# Altium project SolderStation.PrjPcb
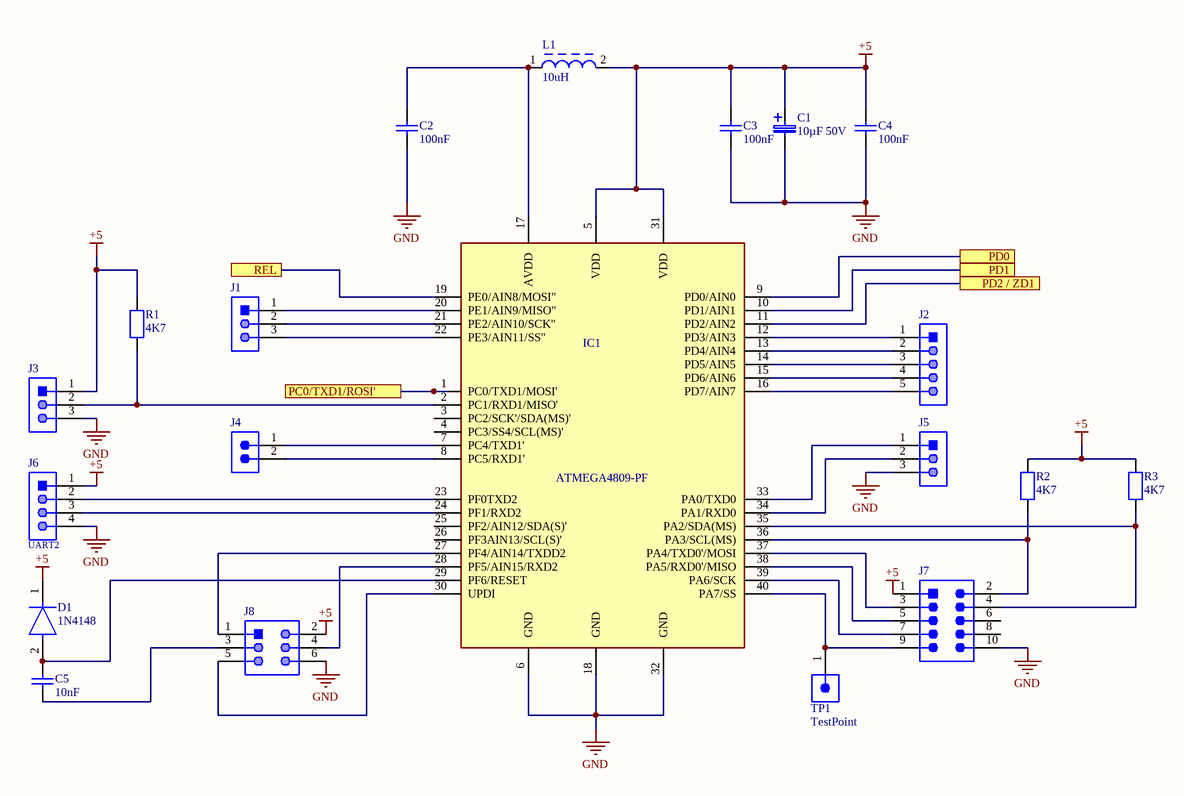
[diagram p0: CPU.SchDoc]
Drawn By: Robert Jansen
4 sheets, 70 parts. Net scope: flat (ports and power ports of the same name join across sheets).
Board file: solderStation.PcbDoc
Sheets:
  CPU.SchDoc
  SolderIronTemp.SchDoc
  SolderIronOut.SchDoc
  BatterySource_RelaisOut.SchDoc

## Sheet CPU.SchDoc
size A4; SheetNumber: 1; SheetTotal: 5

### Parts
C1  10µF 50V  [TAP106M050BRW]
C2  100nF  [CAPC2012X88N]
C3  100nF  [CAPC2012X88N]
C4  100nF  [CAPC2012X88N]
C5  10nF  [CAPC2012X88N]
D1  1N4148  [FP-017AG-MFG]
IC1  ATMEGA4809-PF  [ATMEGA4809-PF]
J1  61300311121  [pin header 1x3]  (value not drawn)
J2  61300511121  [pin header 1x5]  (value not drawn)
J3  61300311121  [pin header 1x3]  (value not drawn)
J4  61300211121  [61300211121]  (value not drawn)
J5  61300311121  [pin header 1x3]  (value not drawn)
J6  UART2  [pin header 1x4]
J7  1-1634688-0  [TECO-1-1634688-0-10_V]  (value not drawn)
J8  61300621121  [pin header 2x6]  (value not drawn)
L1  10uH  [SMD-1008]
R1  4K7  [RESC2012X50N]
R2  4K7  [RESC2012X50N]
R3  4K7  [RESC2012X50N]
TP1  TestPoint  [61300111121]

### Ports
PC0/TXD1/ROSI' (see SolderIronOut[1B]), PD0 (see SolderIronTemp[1A]), PD1 (see SolderIronTemp[1C]), PD2 / ZD1 (see BatterySource_RelaisOut[3B]), REL (see BatterySource_RelaisOut[1C])

### Nets
+5: C1.1 C3.2 C4.2 D1.1(C) IC1.5(VDD) IC1.31(VDD) J3.1 J6.1 J7.1 J8.2 L1.2 R1.1 R2.2 R3.2
GND: C1.2 C2.1 C3.1 C4.1 IC1.6(GND) IC1.18(GND) IC1.32(GND) J3.3 J5.3 J6.4 J7.10 J8.6
NetC2_2: C2.2 IC1.17(AVDD) L1.1
NetC5_1: C5.1 J8.3
NetC5_2: C5.2 D1.2(A) IC1.29(PF6/RESET)
NetC6_2: IC1.9(PD0/AIN0) ; port PD0
NetC10_2: IC1.10(PD1/AIN1) ; port PD1
NetIC1_1: IC1.1(PC0/TXD1/MOSI') ; port PC0/TXD1/ROSI'
NetIC1_2: IC1.2(PC1/RXD1/MISO') J3.2 R1.2
NetIC1_7: IC1.7(PC4/TXD1') J4.1
NetIC1_8: IC1.8(PC5/RXD1') J4.2
NetIC1_11: IC1.11(PD2/AIN2) ; port PD2 / ZD1
NetIC1_12: IC1.12(PD3/AIN3) J2.1
NetIC1_13: IC1.13(PD4/AIN4) J2.2
NetIC1_14: IC1.14(PD5/AIN5) J2.3
NetIC1_15: IC1.15(PD6/AIN6) J2.4
NetIC1_16: IC1.16(PD7/AIN7) J2.5
NetIC1_19: IC1.19(PE0/AIN8/MOSI") ; port REL
NetIC1_20: IC1.20(PE1/AIN9/MISO") J1.1
NetIC1_21: IC1.21(PE2/AIN10/SCK") J1.2
NetIC1_22: IC1.22(PE3/AIN11/SS") J1.3
NetIC1_23: IC1.23(PF0TXD2) J6.2
NetIC1_24: IC1.24(PF1/RXD2) J6.3
NetIC1_27: IC1.27(PF4/AIN14/TXDD2) J8.1
NetIC1_28: IC1.28(PF5/AIN15/RXD2) J8.4
NetIC1_30: IC1.30(UPDI) J8.5
NetIC1_33: IC1.33(PA0/TXD0) J5.1
NetIC1_34: IC1.34(PA1/RXD0) J5.2
NetIC1_35: IC1.35(PA2/SDA(MS)) J7.4 R3.1
NetIC1_36: IC1.36(PA3/SCL(MS)) J7.2 R2.1
NetIC1_37: IC1.37(PA4/TXD0'/MOSI) J7.3
NetIC1_38: IC1.38(PA5/RXD0'/MISO) J7.5
NetIC1_39: IC1.39(PA6/SCK) J7.7
NetIC1_40: IC1.40(PA7/SS) J7.9 TP1.1

Not connected (* = marked no-connect by the designer): IC1 3(PC2/SCK'/SDA(MS)') 4(PC3/SS4/SCL(MS)') 25(PF2/AIN12/SDA(S)') 26(PF3AIN13/SCL(S)'); J7 6 8

### Library data of the parts
C1 = capacitor THT radial tantalum: Tantalum Capacitors - Solid Leaded 50V 10uF 20% ESR=1.6 Ohm TAP106M050BRW; Manufacturer_Name: Kyocera AVX; Geometry.Height: 15.5mm; Mouser Part Number: 581-TAP106M050BRW; Mouser Price/Stock: https://www.mouser.co.uk/ProductDetail/AVX/TAP106M050BRW?qs=GjEaAqXp9rZGx11KfVU76g%3D%3D; Manufacturer_Part_Number: TAP106M050BRW; Datasheet Link: https://www.mouser.be/datasheet/2/40/tap-776819.pdf
C2-C5 = Capacitor ceramic 0805: Manufacturer: Kemet; Part Number: C0402C104K4RACTU
D1 = D 1N4148: DIODE GEN PURP 100V 200MA DO35; Forward Voltage: 1V; Max Power Dissipation: 500mW; Max Reverse Current: 5uA; Forward Current: 300mA; Current: 4A; Reverse Recovery Time: 4ns; Element Configuration: Single; Outside Diameter: 1.85mm; Capacitance: 4pF; Polarity: Standard; Max Forward Surge Current (Ifsm): 1A; Reverse Voltage: 100V; Output Current: 200mA; Average Rectified Current: 200mA; Diameter: 1.91mm; Max Repetitive Reverse Voltage (Vrrm): 100V; Current Rating: 200mA; Case/Package: DO-35; Lead Free: Lead Free; Number of Pins: 2; Recovery Time: 4ns; Packaging: Bulk; Contact Plating: Tin; Voltage: 100V; Mount: Through Hole; Max Surge Current: 4A; Package Quantity: 2000; Width: 1.91mm; Max Reverse Voltage (DC): 100V; Length: 4.56mm; Radiation Hardening: No; Power Dissipation: 500mW; Voltage Rating (DC): 100V; Peak Non-Repetitive Surge Current: 4A; REACH SVHC: No SVHC; Height: 4.56mm; Max Operating Temperature: 175°C; Series: -; Weight: 0.01lb; Min Operating Temperature: -65°C
IC1 = ATMEGA4809-PF: IC MCU 8BIT 48KB FLASH 40DIP; RoHS Compliant: Yes
J1 J3 = pin header 1x3pin right connection: THT Vertical Pin Header WR-PHD, Pitch 2.54 mm, Single Row, 3 pins; Manufacturer: Wurth Elektronik; Withstanding Voltage: 500VAC; Working Voltage: 250VAC; Rated Current: 3A; Pitch: 2.54mm; Pin Number: 3; Gender: Male; Contact Resistance: 20mOhm; Package Reference: 61300311121; Manufacturer URL: http://www.we-online.de; Datasheet URL: https://katalog.we-online.de/em/datasheet/6130xx11121.pdf; Operating Temperature: -40to105degC; Part Number: 61300311121; Orientation: Vertical; Packaging: Bag; Row Number: Single; Mounting Technology: THT; Publisher: WurthElektronik
J2 = pin header 1x5: THT Vertical Pin Header WR-PHD, Pitch 2.54 mm, Single Row, 5 pins; Manufacturer: Wurth Elektronik; Pin Number: 5; Contact Resistance: 20mOhm; Working Voltage: 250VAC; Pitch: 2.54mm; Withstanding Voltage: 500VAC; Rated Current: 3A; Gender: Male; Datasheet URL: https://katalog.we-online.de/em/datasheet/6130xx11121.pdf; Orientation: Vertical; Mounting Technology: THT; Row Number: Single; Package Reference: 61300511121; Publisher: WurthElektronik; Part Number: 61300511121; Packaging: Bag; Manufacturer URL: http://www.we-online.de; Operating Temperature: -40to105degC
J4 = Pin header 1X2 right connection: THT Vertical Pin Header WR-PHD, Pitch 2.54 mm, Single Row, 2 pins; NexarPartId: 20081794; Operating Supply Voltage: 250V; Current Rating: 3A; Gender: Male; Number of Contacts: 2; Pitch: 2.54mm; Connector Type: Male Pin; Contact Resistance: 20mΩ; Contact Plating: Gold; Contact Material: Copper; Number of Pins: 2; Min Operating Temperature: -40°C; Packaging: Bulk; Lead Pitch: 2.54mm; Mount: Through Hole; Orientation: Vertical; RoHS: Compliant; REACH SVHC: No SVHC; Height: 8.94mm; Termination: Through Hole; Number of Positions: 2; Contact Mating Length: 5.9944mm; Color: Black; Contact Gender: Male; Number of Rows: 1; Housing Material: PBT; Lead Free: Lead Free; Voltage Rating: 250V; Max Operating Temperature: 125°C
J5 = pin header 1x3pin: THT Vertical Pin Header WR-PHD, Pitch 2.54 mm, Single Row, 3 pins; Manufacturer: Wurth Elektronik; Withstanding Voltage: 500VAC; Working Voltage: 250VAC; Rated Current: 3A; Pitch: 2.54mm; Pin Number: 3; Gender: Male; Contact Resistance: 20mOhm; Package Reference: 61300311121; Manufacturer URL: http://www.we-online.de; Datasheet URL: https://katalog.we-online.de/em/datasheet/6130xx11121.pdf; Operating Temperature: -40to105degC; Part Number: 61300311121; Orientation: Vertical; Packaging: Bag; Row Number: Single; Mounting Technology: THT; Publisher: WurthElektronik
J6 = pin header 1x4 right connection: THT Vertical Pin Header WR-PHD, Pitch 2.54 mm, Single Row, 4 pins; Manufacturer: Wurth Elektronik; Part Number: 61300411121; Withstanding Voltage: 500VAC; Rated Current: 3A; Working Voltage: 250VAC; Pin Number: 4; Gender: Male; Contact Resistance: 20mOhm; Pitch: 2.54mm; Manufacturer URL: http://www.we-online.de; Operating Temperature: -40to105degC; Packaging: Bag; Mounting Technology: THT; Package Reference: 61300411121; Datasheet URL: https://katalog.we-online.de/em/datasheet/6130xx11121.pdf; Publisher: WurthElektronik; Row Number: Single; Orientation: Vertical
J7 = CMP-2000-05854-1: Male Header, Pitch 2.54 mm, 2 x 5 Postion, Height 9.15 mm, Tail Length 3.2 mm, -40 to 105 degC, RoHS, Bulk; Manufacturer: TE Connectivity; No. of Rows: 2; SVHC: ToBeAdvised; Package Version: Rev. C2, 02/2011; No. of Contacts: 10Contacts; Pitch: 2.54mm; No. of Positions: 10; Contact Termination Type: ThroughHole; Package Description: 10-Pin Connector, Body 20.35 x 8.7 mm, Pitch 2.54 mm; Orientation: Straight; Gender: Header; Mounting Technology: ThroughHole; Product Range: -; PartNumber: 1-1634688-0; Datasheet Version: Rev. C2, 02/2011; Contact Material: Brass; Package URL: https://datasheet.ciiva.com/6831/eng-cd-1634688-c2-6831201.pdf; Package Reference: 1-1634688-0; Pitch Spacing: 2.54mm; Contact Plating: GoldPlatedContacts; Manufacturer URL: http://www.te.com/; Datasheet URL: https://datasheet.ciiva.com/6831/eng-cd-1634688-c2-6831201.pdf
J8 = pin header 2x6: THT Vertical Pin Header WR-PHD, Pitch 2.54 mm, Dual Row, 6 pins; Manufacturer: Wurth Elektronik; Contact Resistance: 20mOhm; Withstanding Voltage: 500VAC; Pin Number: 6; Gender: Male; Pitch: 2.54mm; Working Voltage: 250VAC; Rated Current: 3A; Packaging: Bag; Row Number: Dual; Manufacturer URL: http://www.we-online.de; Part Number: 61300621121; Operating Temperature: -40to105degC; Mounting Technology: THT; Package Reference: 61300621121; Datasheet URL: https://katalog.we-online.de/em/datasheet/6130xx21121.pdf; Orientation: Vertical; Publisher: WurthElektronik
L1 = Choke SMD 10uH: Power Multilayer Inductor WE-PMI, L = 10.00 µH CMP-0227-00001-1; Inductance: 10.00 ÂµH; ComponentLink2Description: Datasheet; PackageDescription: Chip Inductor, 2-Leads, Body 2.5 x 2.0 mm; PackageReference: SMD-1008; ComponentLink1URL: http://www.we-online.com; ComponentLink2URL: http://www.we-online.de/katalog/media/pdf/74479887310.pdf; ComponentLink1Description: Manufacturer Link; PackageVersion: 2008; DatasheetVersion: ver 3, Aug-2009
R1-R3 = resistor 0805: Manufacturer: Vishay Dale; Part Number: CRCW08050000Z0EA
TP1 = TestPoint: NexarPartId: 32855518; Operating Supply Voltage: 250V; Connector Type: Male Pin; Contact Resistance: 20mΩ; Number of Contacts: 1; Gender: Male; Current Rating: 3A; Contact Mating Length: 5.9944mm; Number of Pins: 1; Lead Pitch: 2.54mm; Contact Plating: Gold; RoHS: Compliant; Termination: Solder; Mount: Through Hole; Number of Rows: 1; Orientation: Vertical; Contact Material: Copper; Packaging: Bulk; REACH SVHC: Unknown; Number of Positions: 1; Color: Black

## Sheet SolderIronTemp.SchDoc
size A4; SheetNumber: 2; SheetTotal: 4
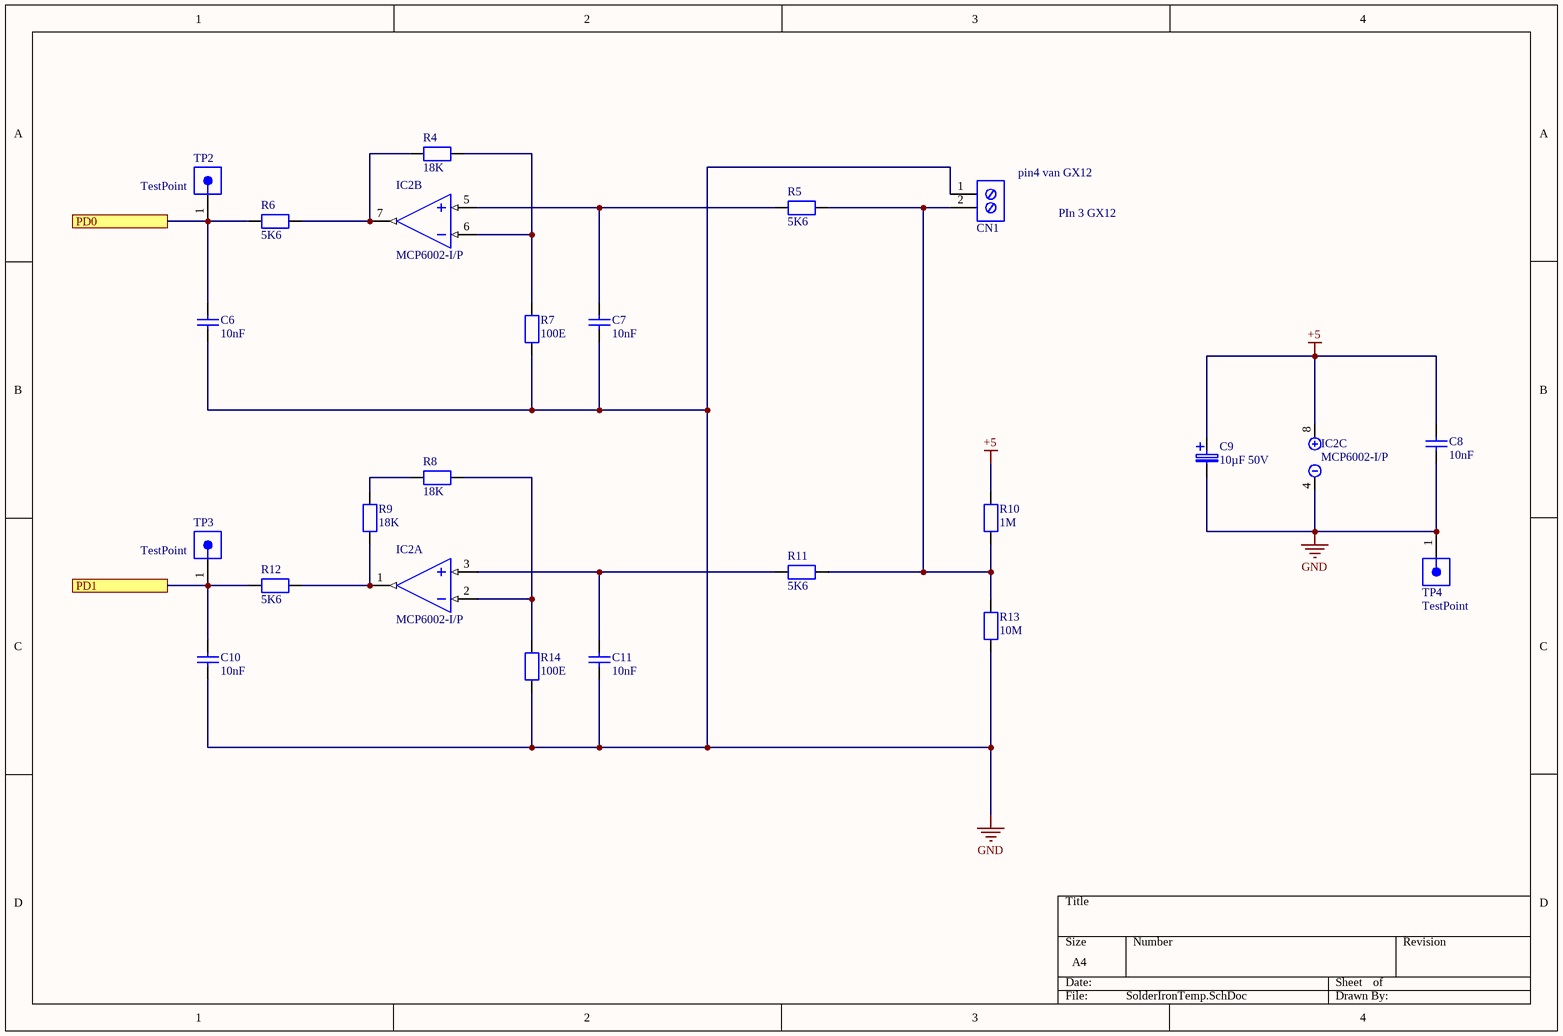
[diagram p1: SolderIronTemp.SchDoc]

### Parts
C6  10nF  [CAPC2012X88N]
C7  10nF  [CAPC2012X88N]
C8  10nF  [CAPC2012X88N]
C9  10µF 50V  [TAP106M050BRW]
C10  10nF  [CAPC2012X88N]
C11  10nF  [CAPC2012X88N]
CN1  Printkroonsteen 2 POL  [Printkroonsteen 2pin]  (value not drawn)
IC2  MCP6002-I/P  [PDIP300-P8]  (parts A,B,C of 3)
R4  18K  [RESC2012X50N]
R5  5K6  [RESC2012X50N]
R6  5K6  [RESC2012X50N]
R7  100E  [RESC2012X50N]
R8  18K  [RESC2012X50N]
R9  18K  [RESC2012X50N]
R10  1M  [RESC2012X50N]
R11  5K6  [RESC2012X50N]
R12  5K6  [RESC2012X50N]
R13  10M  [RESC2012X50N]
R14  100E  [RESC2012X50N]
TP2  TestPoint  [61300111121]
TP3  TestPoint  [61300111121]
TP4  TestPoint  [61300111121]

### Ports
PD0 (see CPU[3B]), PD1 (see CPU[3B])

### Nets
+5: C8.2 C9.1 IC2.8 R10.2
GND: C6.1 C7.1 C8.1 C9.2 C10.1 C11.1 CN1.1 IC2.4 R7.1 R13.1 R14.1 TP4.1
NetC6_2: C6.2 R6.1 TP2.1 ; port PD0
NetC7_2: C7.2 IC2.5(VINB+) R5.1
NetC10_2: C10.2 R12.1 TP3.1 ; port PD1
NetC11_2: C11.2 IC2.3(VINA+) R11.1
NetCN1_2: CN1.2 R5.2 R10.1 R11.2 R13.2
NetIC2_1: IC2.1(VOUTA) R9.1 R12.2
NetIC2_2: IC2.2(VINA-) R8.2 R14.2
NetIC2_6: IC2.6(VINB-) R4.2 R7.2
NetIC2_7: IC2.7(VOUTB) R4.1 R6.2
NetR8_1: R8.1 R9.2

### Notes on the sheet
- (near CN1) pin4 van GX12
- PIn 3 GX12

### Library data of the parts
C6-C8 C10 C11 = Capacitor ceramic 0805: as C2 on sheet CPU
C9 = capacitor THT radial tantalum: as C1 on sheet CPU; Mouser Part Number: 581-TAP106M050BRW; Mouser Price/Stock: https://www.mouser.co.uk/ProductDetail/AVX/TAP106M050BRW?qs=GjEaAqXp9rZGx11KfVU76g%3D%3D; Manufacturer_Part_Number: TAP106M050BRW; Datasheet Link: https://www.mouser.be/datasheet/2/40/tap-776819.pdf
CN1 = printkroonsteen 1 X 2: Printkroonsteen 2 PO L1716020000; Manufacturer_Name: Weidmuller; Datasheet Link: https://catalog.weidmueller.com/catalog/Start.do?ObjectID=1716020000&_ga=2.21797499.1716783809.1613378202-511725545.1613378202; Manufacturer_Part_Number: 1716020000; Mouser Part Number: 470-1716020000; Mouser Price/Stock: https://www.mouser.co.uk/ProductDetail/Weidmuller/1716020000?qs=WJDKaGZ8K%252B7GSEFQgvMjVA%3D%3D
IC2 = CMP-0187-00119-3: Dual opamp; Max Frequency: 1kHz; Operating Supply Current: 100uA; Amplifier Type: GENERAL PURPOSE; Number of Channels: 2; Power Supply Rejection Ratio (PSRR): 86dB; Max Input Voltage: 6V; Bandwidth: 1MHz; Voltage Gain: 112dB; Input Bias Current: 1pA; Slew Rate-Nom: 0.6V/µs; Output Current: 23mA; Input Offset Voltage-Max: 4.5mV; Common Mode Rejection Ratio: 60dB; Min Input Voltage: 1.8V; Operating Supply Voltage: 5.5V; Height: 0.195inch; Number of Circuits: 2; REACH SVHC: No SVHC; Max Supply Voltage: 6V; Supply Current: 100uA; Gain Bandwidth Product: 1MHz; Radiation Hardening: No; Mount: Through Hole; Length: 0.4inch; Number of Pins: 8; Min Operating Temperature: -40°C; Case/Package: PDIP; Number of Amplifiers: 2; RoHS Compliant: Yes; Lead Free: Lead Free; Number of Elements: 2; Technology: CMOS; Width: 0.28inch; Slew Rate: 0.6V/µs; Packaging: Rail/Tube; Output Current per Channel: 23mA; Max Operating Temperature: 85°C; Nominal Supply Current: 100uA; Min Supply Voltage: 1.8V; Input Offset Voltage (Vos): 4.5mV; Unity Gain Bandwidth Product: 1MHz; Package Quantity: 60
R4-R14 = resistor 0805: as R1 on sheet CPU
TP2-TP4 = TestPoint: as TP1 on sheet CPU; Contact Mating Length: 5.9944mm; Number of Pins: 1; Lead Pitch: 2.54mm; Contact Plating: Gold; RoHS: Compliant; Termination: Solder; Mount: Through Hole; Number of Rows: 1; Orientation: Vertical; Contact Material: Copper; Packaging: Bulk; REACH SVHC: Unknown; Number of Positions: 1; Color: Black

## Sheet SolderIronOut.SchDoc: PWM
size 381 x 241 mm; DrawnBy: Jansen Robert; Engineer: Jansen Robert; Organization: PXL; SheetNumber: 3; SheetTotal: 4
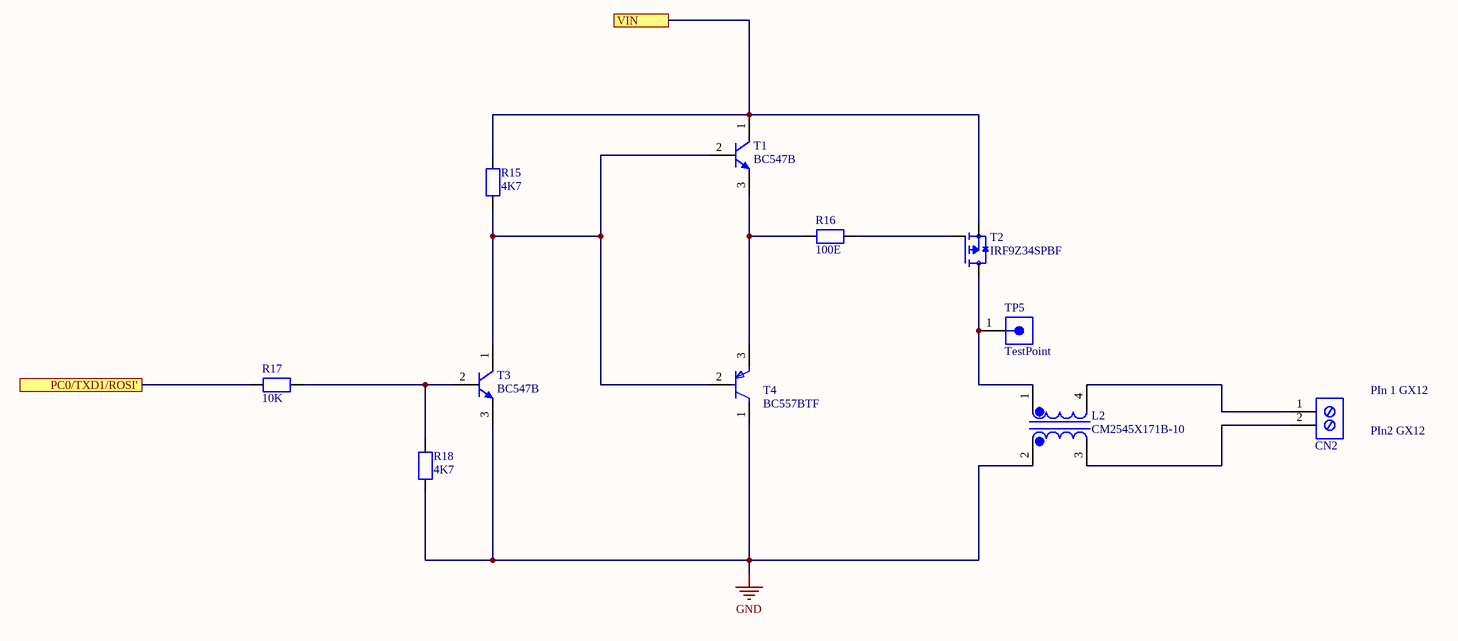
[diagram p2: SolderIronOut.SchDoc]

### Parts
CN2  Printkroonsteen 2 POL  [Printkroonsteen 2pin]  (value not drawn)
L2  CM2545X171B-10  [XFMR_CM2545X171B-10]
R15  4K7  [RESC2012X50N]
R16  100E  [RESC2012X50N]
R17  10K  [RESC2012X50N]
R18  4K7  [RESC2012X50N]
T1  BC547B  [ONSC-TO-92-3-29-11]
T2  IRF9Z34SPBF  [TO254P1521X483-4N]
T3  BC547B  [ONSC-TO-92-3-29-11]
T4  BC557BTF  [ONSC-TO-92-3-29-11]
TP5  TestPoint  [61300111121]

### Ports
PC0/TXD1/ROSI' (see CPU[2B]), VIN (see BatterySource_RelaisOut[3B])

### Nets
GND: L2.2 R18.1 T3.3(E) T4.1(C)
NetCN2_1: CN2.1 L2.4
NetCN2_2: CN2.2 L2.3
NetCN4_2: R15.2 T1.1(C) T2.3(S) ; port VIN
NetIC1_1: R17.2 ; port PC0/TXD1/ROSI'
NetL2_1: L2.1 T2.4(D) TP5.1
NetR15_1: R15.1 T1.2(B) T3.1(C) T4.2(B)
NetR16_1: R16.1 T2.1(G)
NetR16_2: R16.2 T1.3(E) T4.3(E)
NetR17_1: R17.1 R18.2 T3.2(B)

### Notes on the sheet
- PIn 1 GX12
- PIn2 GX12

### Library data of the parts
CN2 = printkroonsteen 1 X 2: as CN1 on sheet SolderIronTemp; Datasheet Link: https://catalog.weidmueller.com/catalog/Start.do?ObjectID=1716020000&_ga=2.21797499.1716783809.1613378202-511725545.1613378202; Manufacturer_Part_Number: 1716020000; Mouser Part Number: 470-1716020000; Mouser Price/Stock: https://www.mouser.co.uk/ProductDetail/Weidmuller/1716020000?qs=WJDKaGZ8K%252B7GSEFQgvMjVA%3D%3D
L2 = CM2545X171B-10: 2 Line Common Mode Choke Through Hole 170 Ohms @ 100 MHz 10A DCR 10mOhm; MF: Laird; Value: *; Purchase-URL: https://pricing.snapeda.com/search/part/CM2545X171B-10/?ref=eda; Price: None; Package: Vertical-4 Laird; SnapEDA_Link: https://www.snapeda.com/parts/CM2545X171B-10/Laird/view-part/?ref=snap; Availability: In Stock; Check_prices: https://www.snapeda.com/parts/CM2545X171B-10/Laird/view-part/?ref=eda; MP: CM2545X171B-10
R15-R18 = resistor 0805: as R1 on sheet CPU
T1 T3 = Transistor NPN BC547B THT: Amplifier Transistor, NPN Silicon, 3-Pin TO-92, Bulk Box CMP-1048-01467-1; Manufacturer: On Semiconductor; IC Continuous (A): 0.1; fT Min (MHz): 150; PackageDescription: 3-Pin Transistor Outline, Body 4.825 x 3.685 mm, Pitch 1.27 mm; ComponentLink3URL: http://www.onsemi.cn/pub_link/Collateral/2N6426-D.PDF; PackageVersion: Rev. AM; Packing: Bulk Box; ComponentLink3Description: Package Specification; ComponentLink2URL: http://www.onsemi.com/pub_link/Collateral/BC546-D.PDF; ComponentLink1URL: http://www.onsemi.com/; ComponentLink2Description: Datasheet; Polarity: NPN; Mounting Technology: Through Hole; PackageReference: TO-92-3-29-11_AM_SL; ComponentLink1Description: Manufacturer URL; PartNumber: BC547B; DatasheetVersion: Rev. 7; RoHS: FALSE
T2 = IRF9Z34SPBF: P-Channel 60V 18A _Tc_ 3.7W _Ta_, 88W _Tc_ Surface Mount D2PAK; MF: Vishay; SnapEDA_Link: https://www.snapeda.com/parts/IRF9Z34SPBF/Vishay%20Siliconix/view-part/390212/?ref=snap; Price: None; MP: IRF9Z34SPBF; Value: *; Availability: Unavailable; Package: D2PAK Vishay
T4 = Transistor PNP BC557 THT: BC557BTF Small Signal Bipolar Transistor, 0.1A I(C), 45V V(BR)CEO, 1-Element, PNP, Silicon, TO-92 CMP-00278-84408945-1; Manufacturer Lifecycle Status: ACTIVE; Max Power Dissipation: 500mW; Frequency: 150MHz; hFE Min: 110; Number of Elements: 1; Current Rating: -100mA; Collector Emitter Saturation Voltage: -250mV; Max Collector Current: 100mA; Emitter Base Voltage (VEBO): -5V; Voltage Rating (DC): -45V; Element Configuration: Single; Max Frequency: 10MHz; Collector Base Voltage (VCBO): -50V; Polarity: PNP; Collector Emitter Voltage (VCEO): 45V; Contact Plating: Tin; Min Operating Temperature: -65°C; RoHS: Compliant; Max Operating Temperature: 150°C; Weight: 240mg; Power Dissipation: 500mW; Lifecycle Status: Production; Case/Package: TO-92; Collector Emitter Breakdown Voltage: 45V; Length: 5.2mm; Schedule B: 8541210080, 8541210080|8541210080|8541210080|8541210080|8541210080; Lead Free: Lead Free; REACH SVHC: No SVHC; Mount: Through Hole; NexarPartId: 84408945; Max Breakdown Voltage: 45V; Transition Frequency: 150MHz; Height: 5.33mm; Number of Pins: 3; Gain Bandwidth Product: 150MHz; Width: 4.19mm
TP5 = TestPoint: as TP1 on sheet CPU; Contact Mating Length: 5.9944mm; Number of Pins: 1; Lead Pitch: 2.54mm; Contact Plating: Gold; RoHS: Compliant; Termination: Solder; Mount: Through Hole; Number of Rows: 1; Orientation: Vertical; Contact Material: Copper; Packaging: Bulk; REACH SVHC: Unknown; Number of Positions: 1; Color: Black

## Sheet BatterySource_RelaisOut.SchDoc
size A4; SheetNumber: 4; SheetTotal: 5
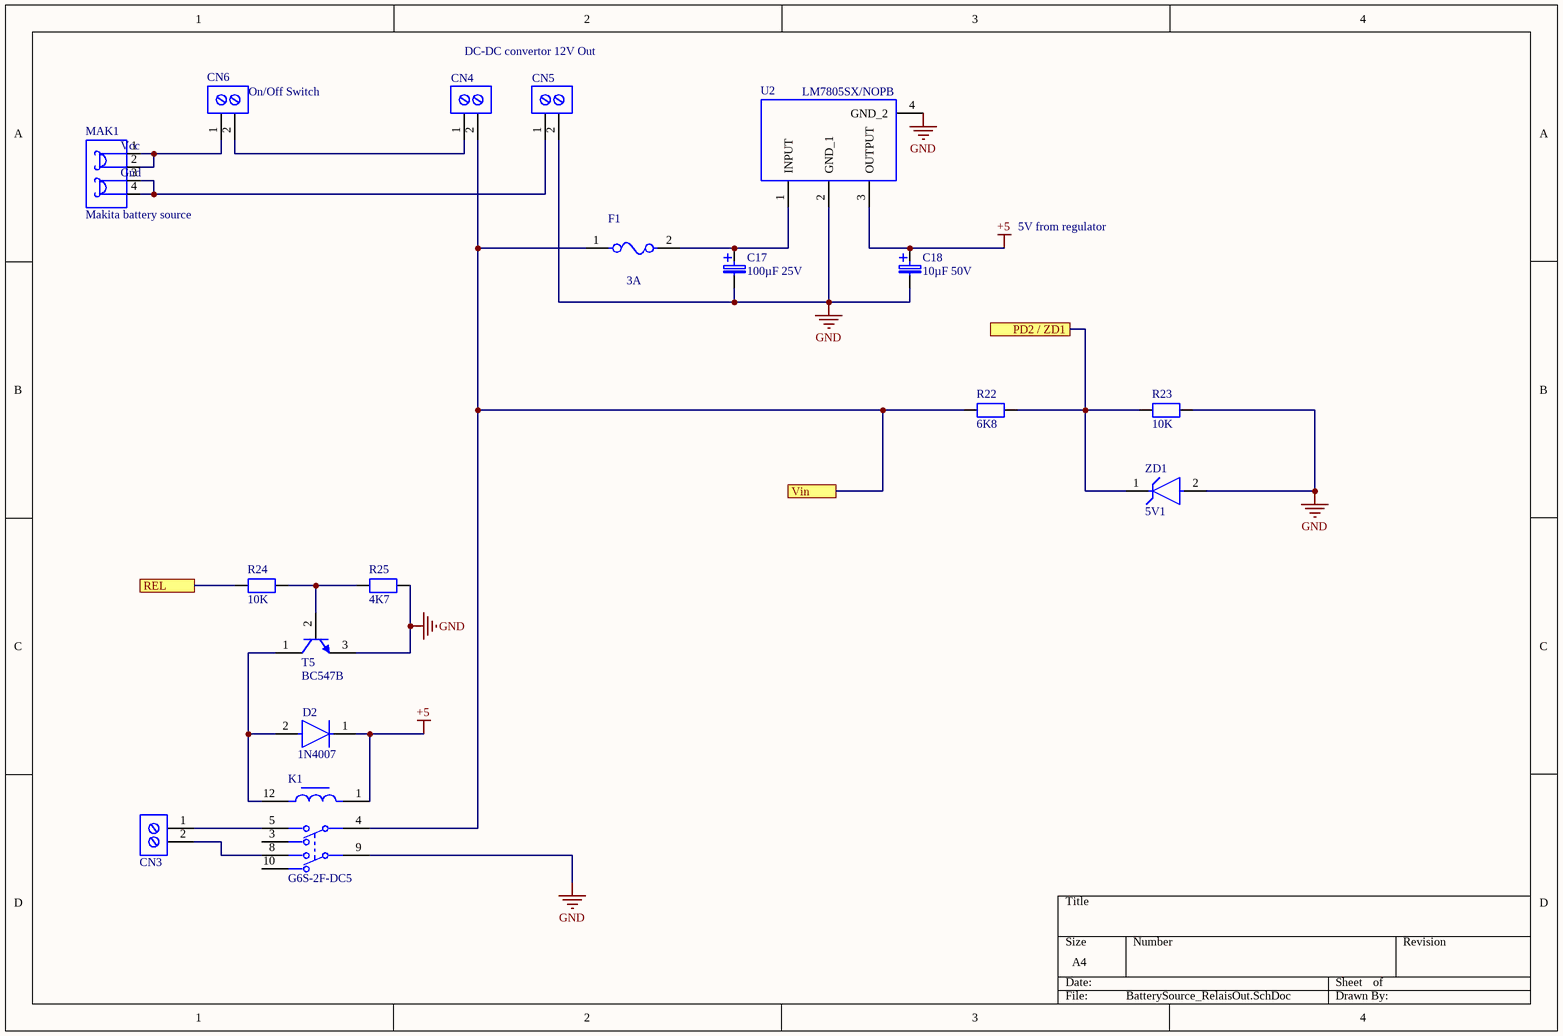
[diagram p3: BatterySource_RelaisOut.SchDoc]

### Parts
C17  100µF 25V  [TAP106M050BRW]
C18  10µF 50V  [TAP106M050BRW]
CN3  Printkroonsteen 2 POL  [Printkroonsteen 2pin]  (value not drawn)
CN4  Printkroonsteen 2 POL  [Printkroonsteen 2pin]  (value not drawn)
CN5  Printkroonsteen 2 POL  [Printkroonsteen 2pin]  (value not drawn)
CN6  On/Off Switch  [Printkroonsteen 2pin]
D2  1N4007  [DIODE 1N4007 ONSC-AXIAL_LEAD-2-59-10_P]
F1  3A  [FP-0154-MFG]
K1  G6S-2F-DC5  [FP-G6S-2F-DC5-MFG]
MAK1  Makita battery source  [makita foodprint female spade for PCD]
R22  6K8  [RESC2012X50N]
R23  10K  [RESC2012X50N]
R24  10K  [RESC2012X50N]
R25  4K7  [RESC2012X50N]
T5  BC547B  [ONSC-TO-92-3-29-11]
U2  LM7805SX/NOPB  [FP-KTT0003B-MFG]
ZD1  5V1  [Zenerdiode TH]

### Ports
PD2 / ZD1 (see CPU[3B]), REL (see CPU[2B]), Vin (see SolderIronOut[3A])

### Nets
+5: C18.1 D2.1(C) K1.1 U2.3(OUTPUT)
GND: C17.2 C18.2 CN5.2 K1.9 R23.2 R25.2 T5.3(E) U2.2(GND_1) U2.4(GND_2) ZD1.2(A)
NetC17_1: C17.1 F1.2 U2.1(INPUT)
NetCN3_1: CN3.1 K1.5
NetCN3_2: CN3.2 K1.8
NetCN4_1: CN4.1 CN6.2
NetCN4_2: CN4.2 F1.1 K1.4 R22.1 ; port Vin
NetCN5_1: CN5.1 MAK1.3 MAK1.4
NetCN6_1: CN6.1 MAK1.1 MAK1.2
NetD2_2: D2.2(A) K1.12 T5.1(C)
NetIC1_11: R22.2 R23.1 ZD1.1(C) ; port PD2 / ZD1
NetIC1_19: R24.1 ; port REL
NetR24_2: R24.2 R25.1 T5.2(B)

Not connected (* = marked no-connect by the designer): K1 3 10

### Notes on the sheet
- DC-DC convertor 12V Out
- 5V from regulator
- (in symbol Makita battery source) Vcc; Gnd

### Library data of the parts
C17 C18 = capacitor THT radial tantalum: as C1 on sheet CPU; Mouser Part Number: 581-TAP106M050BRW; Mouser Price/Stock: https://www.mouser.co.uk/ProductDetail/AVX/TAP106M050BRW?qs=GjEaAqXp9rZGx11KfVU76g%3D%3D; Manufacturer_Part_Number: TAP106M050BRW; Datasheet Link: https://www.mouser.be/datasheet/2/40/tap-776819.pdf
CN3-CN6 = printkroonsteen 1 X 2: as CN1 on sheet SolderIronTemp; Datasheet Link: https://catalog.weidmueller.com/catalog/Start.do?ObjectID=1716020000&_ga=2.21797499.1716783809.1613378202-511725545.1613378202; Manufacturer_Part_Number: 1716020000; Mouser Part Number: 470-1716020000; Mouser Price/Stock: https://www.mouser.co.uk/ProductDetail/Weidmuller/1716020000?qs=WJDKaGZ8K%252B7GSEFQgvMjVA%3D%3D
D2 = DIODE 1N4007: DIODE 1N4007 1A 1000V; Manufacturer: On Semiconductor; IO(rec) Max (A): 1; IFSM Max (A): 30; Packing: Bulk Bag; Type: Standard Recovery; VRRM Max (V): 1000; ComponentLink3URL: http://www.onsemi.cn/pub_link/Collateral/59-10.PDF; PackageVersion: Rev. U, 02/2005; PackageDescription: 2-Pin, Axial Lead, Diameter 2.35 mm; PackageReference: AXIAL_LEAD-2-59-10; RoHS: TRUE; PartNumber: 1N4007; DatasheetVersion: Rev. 13; ComponentLink3Description: Package Specification; ComponentLink1Description: Manufacturer URL; ComponentLink2URL: http://www.onsemi.com/pub_link/Collateral/1N4001-D.PDF; ComponentLink1URL: http://www.onsemi.com/; ComponentLink2Description: Datasheet; Mounting Technology: Through Hole
F1 = Fuse: FUSE BRD MNT 4A 125VAC/VDC 2SMDCMP-08605-000003-1; Manufacturer Part Number: 0154004.DR; Manufacturer: Littelfuse; Fuse Blow Speed: Fast; Max Fuse Ac Voltage: 125V; Lead Free: Yes; Device Class L3: unset; Device Class L2: Fuses; Package: 0154; ComponentLink2Description: Datasheet; Temperature Range Low: -55°C; Temperature Range High: +125°C; Device Class L1: Circuit Protection; Height: 3.81mm; Temperature: -55°C to +125°C; Mouser Description: Surface Mount Fuses Fuseblock w/ fuse 4A OMNI BLOK 154; Automotive: No; Digikey Description: FUSE BRD MNT 4A 125VAC/VDC 2SMD; RoHS: TRUE; Category: Fuse; Fuse Current: 4A; Max Fuse Dc Voltage: 125V; ComponentLink2URL: https://www.littelfuse.com/~/media/electronics/datasheets/fuses/littelfuse_fuse_154_154t_154l_154tl_datasheet.pdf.pdf; Octopart: https://octopart.com/0154004.dr-littelfuse-565861
K1 = relais 5V 2A: RELAY TELECOM DPDT 2A 5V DCCMP-08823-000012-1; Manufacturer: Omron; Coil Resistance: 178Ω; Coil Current: 28.1mA; Standoff Height: 0.35mm; Coil Power: 140mW; Coil Type: Non-Latching; Number Of Contacts: 2; RoHS: TRUE; Device Class L3: Signal Relays; Ambient Temperature Range Low: -40°C; Switching Current: 2A; Device Class L1: Electromechanical; Lead Free: Yes; Category: Relay; Digikey Description: RELAY TELECOM DPDT 2A 5VDC; Height: 9.4mm; Temperature: -40°C to +85°C; Throw Configuration: DPDT; Coil Voltage: 5V; Octopart: https://octopart.com/g6s-2f-dc5-omron-85236; Package: G6S-2F-DC5; Temperature Range High: +85°C; Automotive: No; Current Rating: 2A; Manufacturer Part Number: G6S-2F-DC5; Mouser Description: Electromechanical Relay 5VDC 178Ohm 2A DPDT (14.8x9.2x9.2)mm SMD Signal Relay; Temperature Range Low: -40°C; Device Class L2: Relays; Ambient Temperature Range High: +85°C; ComponentLink2URL: https://omronfs.omron.com/en_US/ecb/products/pdf/en-g6s.pdf; ComponentLink2Description: Datasheet
MAK1 = Makita battery source: complete set-up for bettery makita terminal p/n 644808-8
R22-R25 = resistor 0805: as R1 on sheet CPU
T5 = Transistor NPN BC547B THT: as T1 on sheet SolderIronOut; PackageDescription: 3-Pin Transistor Outline, Body 4.825 x 3.685 mm, Pitch 1.27 mm; ComponentLink3URL: http://www.onsemi.cn/pub_link/Collateral/2N6426-D.PDF; PackageVersion: Rev. AM; Packing: Bulk Box; ComponentLink3Description: Package Specification; ComponentLink2URL: http://www.onsemi.com/pub_link/Collateral/BC546-D.PDF; ComponentLink1URL: http://www.onsemi.com/; ComponentLink2Description: Datasheet; Polarity: NPN; Mounting Technology: Through Hole; PackageReference: TO-92-3-29-11_AM_SL; ComponentLink1Description: Manufacturer URL; PartNumber: BC547B; DatasheetVersion: Rev. 7; RoHS: FALSE
U2 = VoltageRed LM7805 SMD: IC REG LIN 5V 1.5A DDPAK/TO263-3 CMP-2000-07590-2; Manufacturer: Texas Instruments; Standoff Height: 0mm; Number Of Outputs: 1; Nominal Supply Current: 8mA; Output Type: Fixed; Accuracy Percentage: 3%; Dropout Voltage: 2V; Min Supply Voltage: 7.5V; Max Junction Temp: +150°C; Max Supply Voltage: 30V; Device Class L1: Integrated Circuits (ICs); Mouser Description: 1.5-A, Wide VIN Fixed Voltage Regulators 3-DDPAK/TO-263 0 to 0; Device Class L3: Voltage Regulators - Linear; Height: 4.79mm; Temperature Range High: +125°C; Manufacturer Part Number: LM7805SX/NOPB; Octopart: https://octopart.com/lm7805sx%2Fnopb-texas+instruments-74629994; Automotive: No; Output Voltage: 5V; Lead Free: Yes; Digikey Description: IC REG LIN 5V 1.5A DDPAK/TO263-3; Package: KTT0003B; Device Class L2: Power Management ICs; ComponentLink2URL: http://www.ti.com/lit/ds/symlink/lm7800.pdf; Category: IC; Temperature Range Low: 0°C; Ambient Temperature Range High: +125°C; Output Current: 1.5A; Ambient Temperature Range Low: 0°C; RoHS: TRUE; Temperature: 0°C to +125°C; ComponentLink2Description: Datasheet
ZD1 = ZenerDiode: Series 500 mW 5.1 V 200 mA Through Hole Zener Diode - DO-35; Manufacturer Lifecycle Status: ACTIVE; NexarPartId: 13696926; Max Junction Temperature (Tj): 200°C; Reverse Voltage: 7V; Max Power Dissipation: 500mW; Voltage Tolerance: 5%; Zener Current: 20mA; ESD Protection: No; Forward Voltage: 1.2V; Breakdown Voltage: 9.1V; Element Configuration: Single; Peak Reverse Current: 3µA; Impedance: 10Ω; RoHS: Compliant; Mount: Through Hole; Length: 6.35m; Contact Plating: Tin; Weight: 80g; Height: 1.91mm; Number of Pins: 2; Lead Free: Lead Free; Lifecycle Status: Production; Width: 6.35m; Packaging: Bulk; REACH SVHC: No SVHC; Tolerance: 5%; Max Operating Temperature: 200°C; Voltage Rating (DC): 9.1V; Power Dissipation: 500mW; Min Operating Temperature: -65°C; Power Rating: 500mW; Zener Voltage: 9.1V; Schedule B: 8541100050, 8541100050|8541100050|8541100050|8541100050|8541100050; Case/Package: Axial; Test Current: 20mA; Working Voltage: 9.1V; Radiation Hardening: No; Max Reverse Leakage Current: 3µA

## Nets that join several sheets
+5: CPU (14 pins), SolderIronTemp (C8.2 C9.1 IC2.8 R10.2), BatterySource_RelaisOut (C18.1 D2.1 K1.1 U2.3)
GND: CPU (12 pins), SolderIronTemp (12 pins), SolderIronOut (L2.2 R18.1 T3.3 T4.1), BatterySource_RelaisOut (10 pins)
NetC6_2: CPU (IC1.9), SolderIronTemp (C6.2 R6.1 TP2.1)
NetC10_2: CPU (IC1.10), SolderIronTemp (C10.2 R12.1 TP3.1)
NetCN4_2: SolderIronOut (R15.2 T1.1 T2.3), BatterySource_RelaisOut (CN4.2 F1.1 K1.4 R22.1)
NetIC1_1: CPU (IC1.1), SolderIronOut (R17.2)
NetIC1_11: CPU (IC1.11), BatterySource_RelaisOut (R22.2 R23.1 ZD1.1)
NetIC1_19: CPU (IC1.19), BatterySource_RelaisOut (R24.1)